# EasyEDA schematic SCH_dupe_2026-03-27.json
TITLE: Dupe SAO; REV: 2.0; Date: 2025-01-01; Sheet: 1/1; Drawn By: deshipu; Company: deshipu
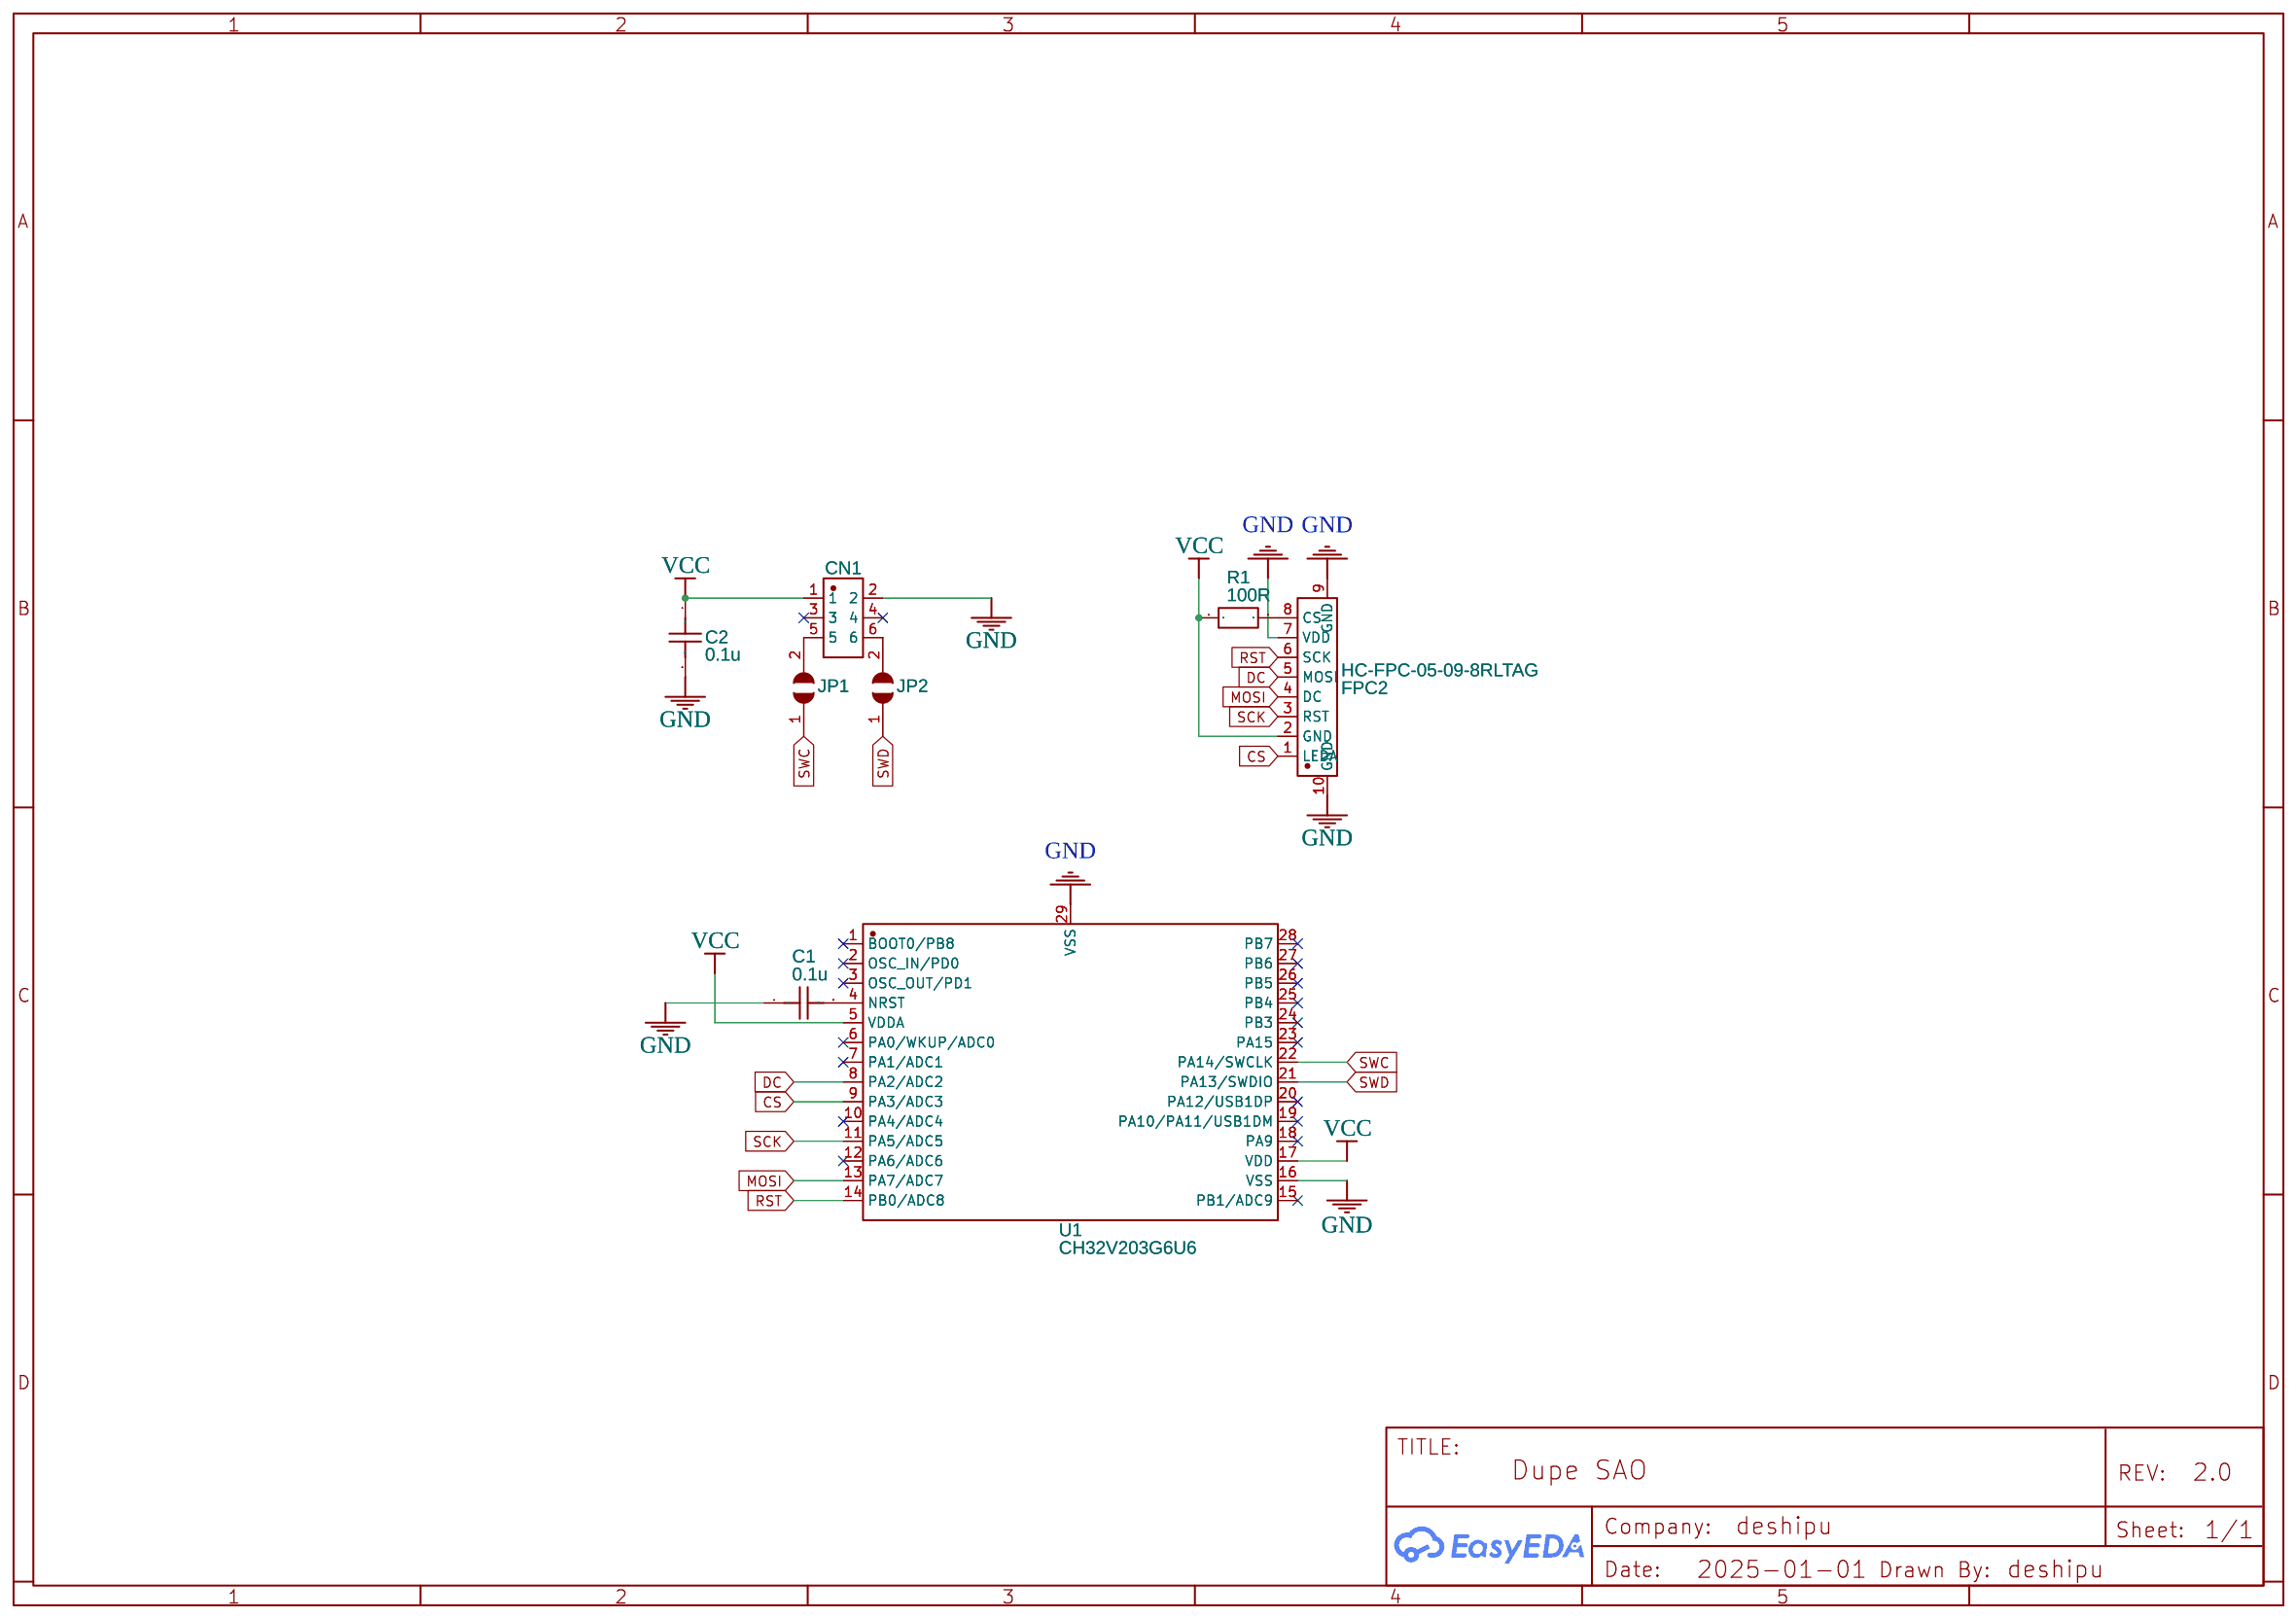
[diagram p0: schematic sheet]

## Parts
C1  0.1u  [C0603]
C2  0.1u  [C0603]
CN1  BH254VS-6P  [CONN-SMD_6P-P2.54_BH254VS]
FPC2  HC-FPC-05-09-8RLTAG  [FPC-SMD_8P-P0.50_HC-FPC-05-09-8RLTAG]
JP1  JUMPER-1-WAY-RocketScreamKicadLibrary  [JUMPER-1-WAY-SMD]
JP2  JUMPER-1-WAY-RocketScreamKicadLibrary  [JUMPER-1-WAY-SMD]
R1  100R  [R0603]
U1  CH32V203G6U6  [QFN-28_L4.0-W4.0-P0.40-BL-EP2.7]

## Library data of the parts
C1 C2 = C_0603_US: Contributor: LCEDA_Lib
CN1 = BH254VS-6P: Contributor: LCSC; Supplier: LCSC; Supplier Part: C492445; Manufacturer: XFCN(兴飞); JLCPCB Part Class: Extended Part
FPC2 = HC-FPC-05-09-8RLTAG: Contributor: lcsc; Supplier: LCSC; Supplier Part: C5213749; Manufacturer: HCTL(华灿天禄); JLCPCB Part Class: Extended Part
JP1 JP2 = JUMPER-1-WAY-RocketScreamKicadLibrary: Contributor: MOS-FET
R1 = R_0603_EU: Contributor: LCEDA_Lib
U1 = CH32V203G6U6: Supplier: LCSC; Supplier Part: C5142280; Manufacturer: WCH(南京沁恒); JLCPCB Part Class: Extended Part; Contributor: lcsc

## Nets
GND: C1.1 C2.2 CN1.2 FPC2.7(VDD) FPC2.9(GND) FPC2.10(GND) U1.16(VSS) U1.29(VSS)
VCC: C2.1 CN1.1 FPC2.2(GND) R1.1 U1.5(VDDA) U1.17(VDD)
CS: FPC2.1(LEDA) U1.9(PA3/ADC3)
DC: FPC2.5(MOSI) U1.8(PA2/ADC2)
MOSI: FPC2.4(DC) U1.13(PA7/ADC7)
RST: FPC2.6(SCK) U1.14(PB0/ADC8)
SCK: FPC2.3(RST) U1.11(PA5/ADC5)
SWC: JP1.1 U1.22(PA14/SWCLK)
SWD: JP2.1 U1.21(PA13/SWDIO)
Net-(C1-2): C1.2 U1.4(NRST)
Net-(CN1-5): CN1.5 JP1.2
Net-(CN1-6): CN1.6 JP2.2
Net-(FPC2-8): FPC2.8(CS) R1.2

Not connected (* = marked no-connect by the designer): CN1 3* 4*; U1 1(BOOT0/PB8)* 2(OSC_IN/PD0)* 3(OSC_OUT/PD1)* 6(PA0/WKUP/ADC0)* 7(PA1/ADC1)* 10(PA4/ADC4)* 12(PA6/ADC6)* 15(PB1/ADC9)* 18(PA9)* 19(PA10/PA11/USB1DM)* 20(PA12/USB1DP)* 23(PA15)* 24(PB3)* 25(PB4)* 26(PB5)* 27(PB6)* 28(PB7)*
